# EasyEDA schematic RawDevBoard.json
TITLE: Daisy Seed Dev Board; REV: 1.0; Date: 2023-09-30; Sheet: 1/1
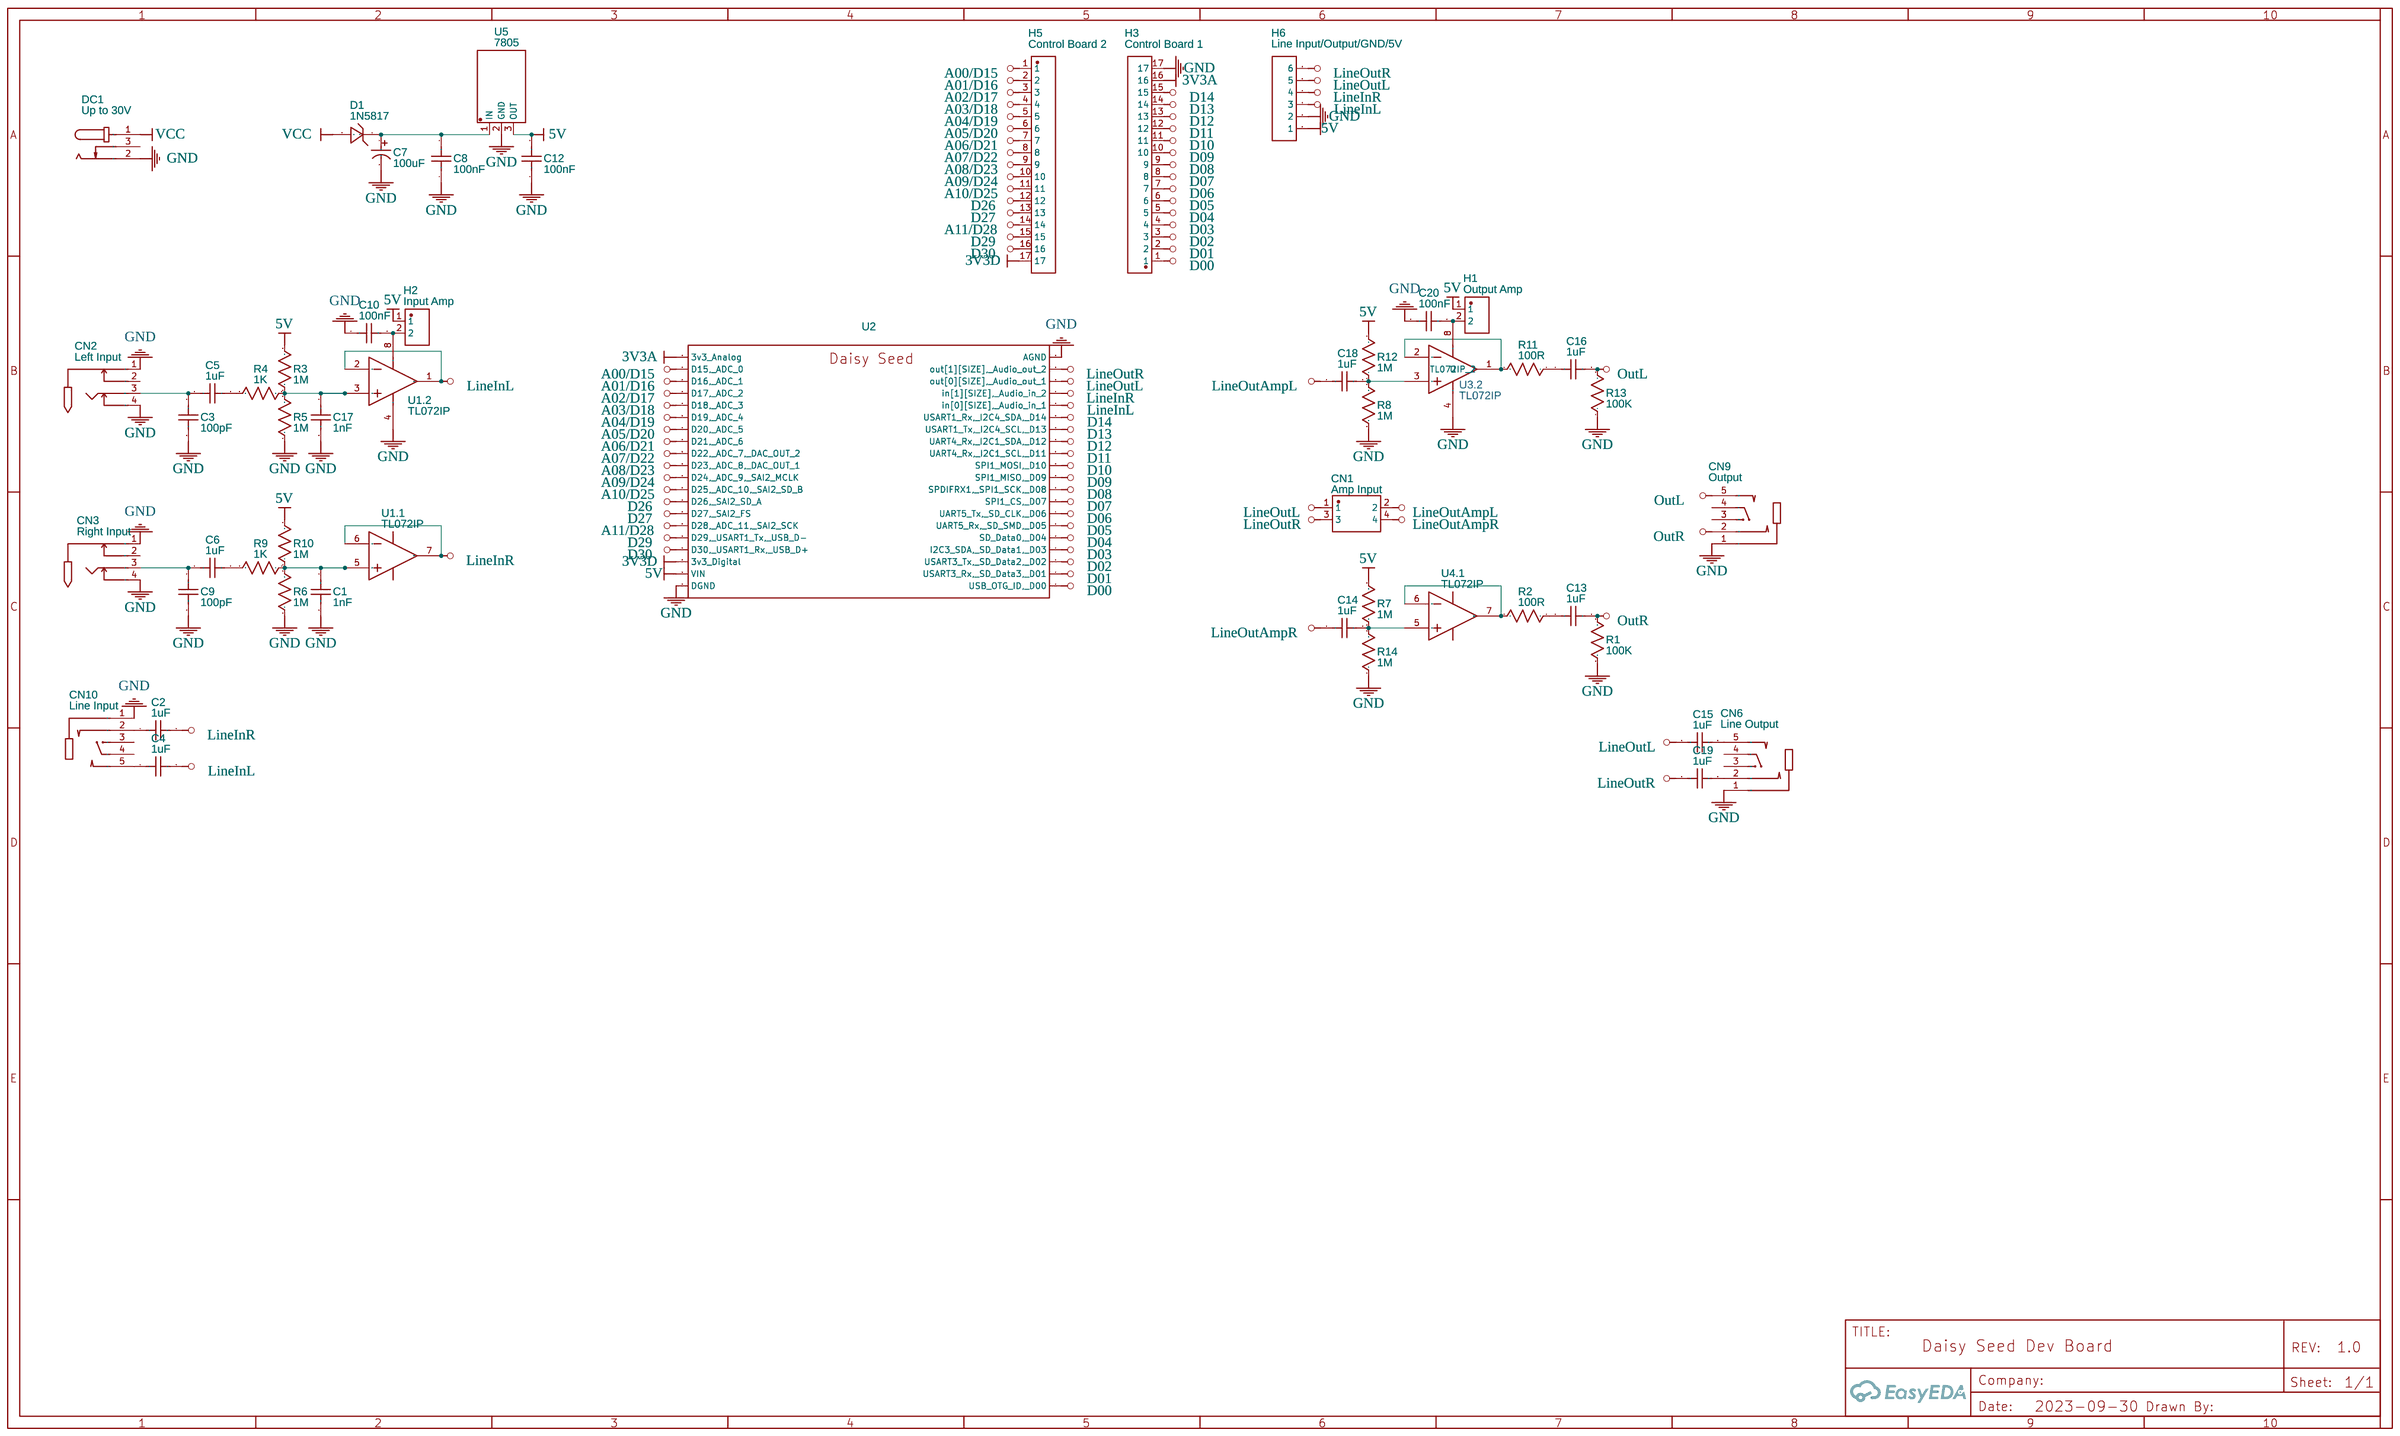
[diagram p0: schematic sheet]

## Parts
C1  1nF  [CAP-TH_L8.0-W4.0-P5.00-D0.7]
C2  1uF  [CAP-TH_L8.0-W4.0-P5.00-D0.7]
C3  100pF  [CAP-TH_L8.0-W4.0-P5.00-D0.7]
C4  1uF  [CAP-TH_L8.0-W4.0-P5.00-D0.7]
C5  1uF  [CAP-TH_L8.0-W4.0-P5.00-D0.7]
C6  1uF  [CAP-TH_L8.0-W4.0-P5.00-D0.7]
C7  100uF  [CAP-TH_BD5.0-P2.00-D0.8-FD]
C8  100nF  [CAP-TH_L8.0-W4.0-P5.00-D0.7]
C9  100pF  [CAP-TH_L8.0-W4.0-P5.00-D0.7]
C10  100nF  [CAP-TH_L8.0-W4.0-P5.00-D0.7]
C12  100nF  [CAP-TH_L8.0-W4.0-P5.00-D0.7]
C13  1uF  [CAP-TH_L8.0-W4.0-P5.00-D0.7]
C14  1uF  [CAP-TH_L8.0-W4.0-P5.00-D0.7]
C15  1uF  [CAP-TH_L8.0-W4.0-P5.00-D0.7]
C16  1uF  [CAP-TH_L8.0-W4.0-P5.00-D0.7]
C17  1nF  [CAP-TH_L8.0-W4.0-P5.00-D0.7]
C18  1uF  [CAP-TH_L8.0-W4.0-P5.00-D0.7]
C19  1uF  [CAP-TH_L8.0-W4.0-P5.00-D0.7]
C20  100nF  [CAP-TH_L8.0-W4.0-P5.00-D0.7]
CN1  Amp Input  [HDR-TH_4P-P2.54-V-M-R2-C2-S2.54-1]
CN2  Left Input  [AUDIO-TH_CK6.35-3-15-6]
CN3  Right Input  [AUDIO-TH_CK6.35-3-15-6]
CN6  Line Output  [AUDIO-TH_XKB_PJ-3062-HD-R]
CN9  Output  [AUDIO-TH_XKB_PJ-3062-HD-R]
CN10  Line Input  [AUDIO-TH_XKB_PJ-3062-HD-R]
D1  1N5817  [DO-41_BD2.4-L4.7-P8.70-D0.9-RD]
DC1  Up to 30V  [CONN-TH_DC-005-2.5A-2.0]
H1  Output Amp  [HDR-TH_2P-P2.00-V-M]
H2  Input Amp  [HDR-TH_2P-P2.00-V-M]
H3  Control Board 1  [HDR-TH_17P-P2.54-V-M]
H5  Control Board 2  [HDR-TH_17P-P2.54-V-M]
H6  Line Input/Output/GND/5V  [HDR-TH_6P-P2.54-V-M-1]
R1  100K  [PS-RES-16.5*6.42]
R2  100R  [PS-RES-16.5*6.42]
R3  1M  [PS-RES-16.5*6.42]
R4  1K  [PS-RES-16.5*6.42]
R5  1M  [PS-RES-16.5*6.42]
R6  1M  [PS-RES-16.5*6.42]
R7  1M  [PS-RES-16.5*6.42]
R8  1M  [PS-RES-16.5*6.42]
R9  1K  [PS-RES-16.5*6.42]
R10  1M  [PS-RES-16.5*6.42]
R11  100R  [PS-RES-16.5*6.42]
R12  1M  [PS-RES-16.5*6.42]
R13  100K  [PS-RES-16.5*6.42]
R14  1M  [PS-RES-16.5*6.42]
U  TL072IP_2
U1  TL072IP  [PDIP-8_L10.2-W5.9-P2.54-LS7.6-BL]  (sections 1,2)
U2  Daisy Seed  [DAISY_SEED]
U4  TL072IP  [PDIP-8_L10.2-W5.9-P2.54-LS7.6-BL]  (section 1)
U5  7805  [TO-220-3_L10.0-W4.5-P2.54-L]

## Library data of the parts
C1-C6 C8-C10 C12-C20 = R08B1B102KN0B0S0N0: Contributor: LCSC; Supplier: LCSC; Supplier Part: C249166; Manufacturer: STE(松田); JLCPCB Part Class: Extended Part; link: https://lcsc.com/eda_search?q=C249166&%26type=1&ref=editor
C7 = 4.7uF 50V 5*11: Supplier: LCSC; Manufacturer: CX(承兴); Manufacturer Part: KM475M050D11RR0VH2FP0; Supplier Part: C43344; JLCPCB Part Class: Extended Part; link: https://lcsc.com/eda_search?q=C43344&%26type=1&ref=editor
CN1 = RF-H042TD-1190 (LF)(SN): Contributor: LCSC; Supplier: LCSC; Supplier Part: C160338; Manufacturer: JST; Manufacturer Part: RF-H042TD-1190(LF)(SN); JLCPCB Part Class: Extended Part; link: https://lcsc.com/eda_search?q=C160338&%26type=1&ref=editor
CN2 CN3 = CK6.35-3+15-6: Contributor: LCSC; Supplier: LCSC; Supplier Part: C718060; Manufacturer: JINJIA(金佳); JLCPCB Part Class: Extended Part; link: https://lcsc.com/eda_search?q=C718060&%26type=1&ref=editor
CN6 CN9 CN10 = PJ-3062-HD-R: Contributor: LCSC; Supplier: LCSC; Supplier Part: C668225; Manufacturer: XKB Connectivity(中国星坤); JLCPCB Part Class: Extended Part; link: https://lcsc.com/eda_search?q=C668225&%26type=1&ref=editor
D1 = 1N5817_C360254: Contributor: LCSC; Supplier: LCSC; Supplier Part: C360254; Manufacturer: PINGWEI(平伟); JLCPCB Part Class: Extended Part
DC1 = DC-005-2.5A-2.5: Contributor: LCSC; Supplier: LCSC; Supplier Part: C319098; Manufacturer: XKB Connectivity(中国星坤); JLCPCB Part Class: Extended Part
H1 H2 = MTP220-1102S1: Contributor: LCSC; Supplier: LCSC; Supplier Part: C376075; Manufacturer: MINTRON(明硕); JLCPCB Part Class: Extended Part; link: https://lcsc.com/eda_search?q=C376075&%26type=1&ref=editor
H3 H5 = PZ254-1-17-Z-8.5: Contributor: LCSC; Supplier: LCSC; Supplier Part: C2894940; Manufacturer: HCTL(华灿天禄); JLCPCB Part Class: Extended Part
H6 = Header-Male-2.54_1x6: Supplier: LCSC; Manufacturer: BOOMELE(博穆精密); Manufacturer Part: 2.54-1x6P直针; Supplier Part: C37208; JLCPCB Part Class: Extended Part
R1-R14 = R_0603_US: Contributor: LCEDA_Lib
U = TL072IP_2: Manufacturer Part: TL072IP; Manufacturer: TI(德州仪器); Supplier Part: C110329; Supplier: LCSC
U1 U4 = TL072IP: subpart_no: 1; Supplier Part: C110329; Supplier: LCSC; Manufacturer: TI(德州仪器); JLCPCB Part Class: Extended Part
U2 = Daisy Seed: Contributor: jjmens
U5 = 7805: Contributor: LCSC; Supplier: LCSC; Supplier Part: C305416; Manufacturer: BLUE ROCKET(蓝箭); JLCPCB Part Class: Extended Part

## Nets
3V3A: H3.16 U2.21(3v3_Analog)
3V3D: H5.17 U2.38(3v3_Digital)
5V: C12.2 H1.1 H2.1 H6.1 R3.2 R7.2 R10.2 R12.2 U2.39(VIN) U5.3(OUT)
GND: C1.2 C3.2 C7.2 C8.1 C9.2 C10.1 C12.1 C17.2 C20.1 CN2.1 CN2.4 CN3.1 CN3.4 CN6.1 CN9.1 CN10.1 DC1.2 H3.17 H6.2 R1.1 R5.1 R6.1 R8.1 R13.1 R14.1 U.4(VCC-) U1.4(VCC-) U2.20(AGND) U2.40(DGND) U5.2(GND)
VCC: D1.2(A) DC1.1
A00/D15: H5.1 U2.22(D15,_ADC_0)
A01/D16: H5.2 U2.23(D16,_ADC_1)
A02/D17: H5.3 U2.24(D17,_ADC_2)
A03/D18: H5.4 U2.25(D18,_ADC_3)
A04/D19: H5.5 U2.26(D19,_ADC_4)
A05/D20: H5.6 U2.27(D20,_ADC_5)
A06/D21: H5.7 U2.28(D21,_ADC_6)
A07/D22: H5.8 U2.29(D22,_ADC_7,_DAC_OUT_2)
A08/D23: H5.9 U2.30(D23,_ADC_8,_DAC_OUT_1)
A09/D24: H5.10 U2.31(D24,_ADC_9,_SAI2_MCLK)
A10/D25: H5.11 U2.32(D25,_ADC_10,_SAI2_SD_B)
A11/D28: H5.14 U2.35(D28,_ADC_11,_SAI2_SCK)
D00: H3.1 U2.1(USB_OTG_ID,_D00)
D01: H3.2 U2.2(USART3_Rx,_SD_Data3,_D01)
D02: H3.3 U2.3(USART3_Tx,_SD_Data2,_D02)
D03: H3.4 U2.4(I2C3_SDA,_SD_Data1,_D03)
D04: H3.5 U2.5(SD_Data0,_D04)
D05: H3.6 U2.6(UART5_Rx,_SD_SMD,_D05)
D06: H3.7 U2.7(UART5_Tx,_SD_CLK,_D06)
D07: H3.8 U2.8(SPI1_CS,_D07)
D08: H3.9 U2.9(SPDIFRX1,_SPI1_SCK,_D08)
D09: H3.10 U2.10(SPI1_MISO,_D09)
D10: H3.11 U2.11(SPI1_MOSI,_D10)
D11: H3.12 U2.12(UART4_Rx,_I2C1_SCL,_D11)
D12: H3.13 U2.13(UART4_Rx,_I2C1_SDA,_D12)
D13: H3.14 U2.14(USART1_Tx,_I2C4_SCL,_D13)
D14: H3.15 U2.15(USART1_Rx,_I2C4_SDA,_D14)
D26: H5.12 U2.33(D26,_SAI2_SD_A)
D27: H5.13 U2.34(D27,_SAI2_FS)
D29: H5.15 U2.36(D29,_USART1_Tx,_USB_D-)
D30: H5.16 U2.37(D30,_USART1_Rx,_USB_D+)
LineInL: C4.2 H6.3 U1.1(OUT1) U1.2(IN1-) U2.16(in[0][SIZE],_Audio_in_1)
LineInR: C2.2 H6.4 U1.6(IN2-) U1.7(OUT2) U2.17(in[1][SIZE],_Audio_in_2)
LineOutAmpL: C18.1 CN1.2
LineOutAmpR: C14.1 CN1.4
LineOutL: C15.1 CN1.1 H6.5 U2.18(out[0][SIZE],_Audio_out_1)
LineOutR: C19.1 CN1.3 H6.6 U2.19(out[1][SIZE],_Audio_out_2)
OutL: C16.2 CN9.5 R13.2
OutR: C13.2 CN9.2 R1.2
Net-(C2-Pad1): C2.1 CN10.2
Net-(C3-Pad1): C3.1 C5.1 CN2.3
Net-(C4-Pad1): C4.1 CN10.5
Net-(C5-Pad2): C5.2 R4.2
Net-(C6-Pad1): C6.1 C9.1 CN3.3
Net-(C6-Pad2): C6.2 R9.2
Net-(C13-Pad1): C13.1 R2.1
Net-(C15-Pad2): C15.2 CN6.5
Net-(C16-Pad1): C16.1 R11.1
Net-(C19-Pad2): C19.2 CN6.2
Net-(D1-C): C7.1 C8.2 D1.1(C) U5.1(IN)
Net-(U1.1-IN2+): C1.1 R6.2 R9.1 R10.1 U1.5(IN2+)
Net-(U1.2-IN1+): C17.1 R3.1 R4.1 R5.2 U1.3(IN1+)
Net-(U1.2-VCC+): C10.2 H2.2 U1.8(VCC+)
Net-(U4.1-IN2+): C14.2 R7.1 R14.2 U4.5(IN2+)
Net-(U4.1-IN2-): R2.2 U4.6(IN2-) U4.7(OUT2)
Net-(U-IN1+): C18.2 R8.2 R12.1 U.3(IN1+)
Net-(U-IN1-): R11.2 U.1(OUT1) U.2(IN1-)
Net-(U-VCC+): C20.2 H1.2 U.8(VCC+)

Not connected (* = marked no-connect by the designer): CN2 2; CN3 2; CN6 3 4; CN9 3 4; CN10 3 4; DC1 3

## Notes on the sheet
- U3.2
- TL072IP
